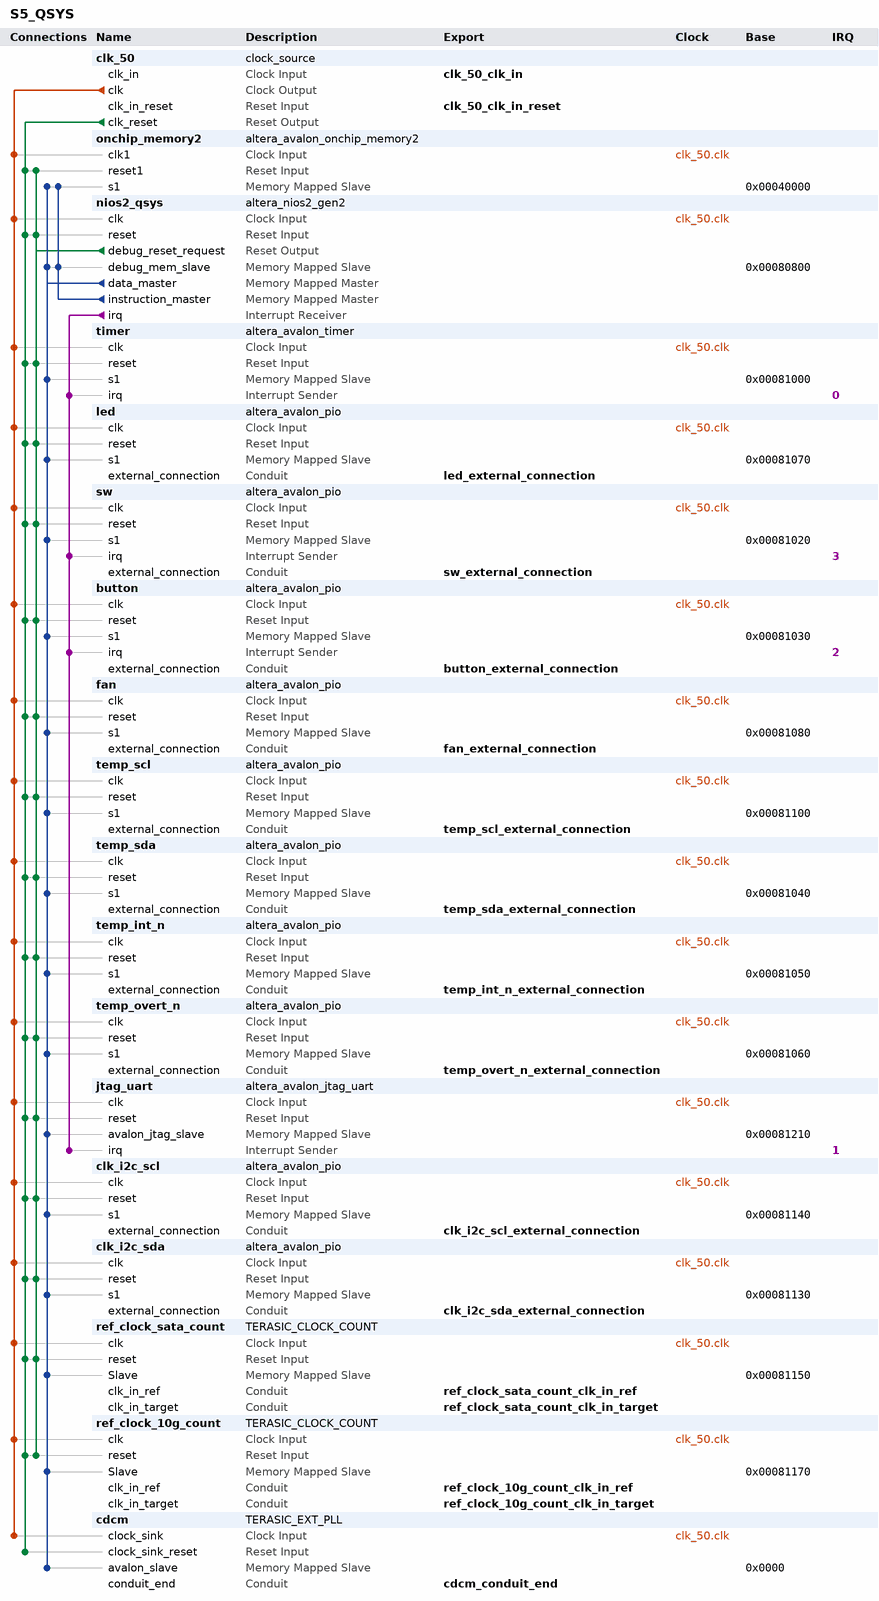
[diagram p0: system contents]
# Platform Designer (Qsys) system S5_QSYS, Stratix V 5SGXEA7N2F45C2
# Parameters at their usual value, and those the tool derives, are not listed.
package require -exact qsys 16.1
create_system S5_QSYS
set_project_property DEVICE_FAMILY {Stratix V}
set_project_property DEVICE 5SGXEA7N2F45C2

add_instance clk_50 clock_source 16.1
set_instance_parameter_value clk_50 clockFrequency 50000000

add_instance onchip_memory2 altera_avalon_onchip_memory2 16.1
set_instance_parameter_value onchip_memory2 dataWidth 32
set_instance_parameter_value onchip_memory2 dualPort false
set_instance_parameter_value onchip_memory2 initMemContent true
set_instance_parameter_value onchip_memory2 initializationFileName onchip_memory2
set_instance_parameter_value onchip_memory2 memorySize 256000

add_instance nios2_qsys altera_nios2_gen2 16.1
set_instance_parameter_value nios2_qsys dcache_size 2048
set_instance_parameter_value nios2_qsys exceptionSlave onchip_memory2.s1
set_instance_parameter_value nios2_qsys icache_size 4096
set_instance_parameter_value nios2_qsys impl Fast
set_instance_parameter_value nios2_qsys resetSlave onchip_memory2.s1
set_instance_parameter_value nios2_qsys setting_activateTrace true

add_instance timer altera_avalon_timer 16.1
set_instance_parameter_value timer period 1
set_instance_parameter_value timer periodUnits MSEC

add_instance led altera_avalon_pio 16.1
set_instance_parameter_value led direction Output
set_instance_parameter_value led width 4

add_instance sw altera_avalon_pio 16.1
set_instance_parameter_value sw captureEdge true
set_instance_parameter_value sw direction Input
set_instance_parameter_value sw edgeType ANY
set_instance_parameter_value sw generateIRQ true
set_instance_parameter_value sw irqType EDGE
set_instance_parameter_value sw width 4

add_instance button altera_avalon_pio 16.1
set_instance_parameter_value button captureEdge true
set_instance_parameter_value button direction Input
set_instance_parameter_value button edgeType FALLING
set_instance_parameter_value button generateIRQ true
set_instance_parameter_value button irqType EDGE
set_instance_parameter_value button width 4

add_instance fan altera_avalon_pio 16.1
set_instance_parameter_value fan direction Output
set_instance_parameter_value fan resetValue 1
set_instance_parameter_value fan width 1

add_instance temp_scl altera_avalon_pio 16.1
set_instance_parameter_value temp_scl direction Output
set_instance_parameter_value temp_scl width 1

add_instance temp_sda altera_avalon_pio 16.1
set_instance_parameter_value temp_sda direction Bidir
set_instance_parameter_value temp_sda width 1

add_instance temp_int_n altera_avalon_pio 16.1
set_instance_parameter_value temp_int_n direction Input
set_instance_parameter_value temp_int_n width 1

add_instance temp_overt_n altera_avalon_pio 16.1
set_instance_parameter_value temp_overt_n direction Input
set_instance_parameter_value temp_overt_n width 1

add_instance jtag_uart altera_avalon_jtag_uart 16.1
set_instance_parameter_value jtag_uart simInteractiveOptions INTERACTIVE_ASCII_OUTPUT

add_instance clk_i2c_scl altera_avalon_pio 16.1
set_instance_parameter_value clk_i2c_scl direction Output
set_instance_parameter_value clk_i2c_scl width 1

add_instance clk_i2c_sda altera_avalon_pio 16.1
set_instance_parameter_value clk_i2c_sda direction Bidir
set_instance_parameter_value clk_i2c_sda width 1

add_instance ref_clock_sata_count TERASIC_CLOCK_COUNT 1.0

add_instance ref_clock_10g_count TERASIC_CLOCK_COUNT 1.0

add_instance cdcm TERASIC_EXT_PLL 1.0

# connections
add_connection clk_50.clk button.clk clock
add_connection clk_50.clk cdcm.clock_sink clock
add_connection clk_50.clk clk_i2c_scl.clk clock
add_connection clk_50.clk clk_i2c_sda.clk clock
add_connection clk_50.clk fan.clk clock
add_connection clk_50.clk jtag_uart.clk clock
add_connection clk_50.clk led.clk clock
add_connection clk_50.clk nios2_qsys.clk clock
add_connection clk_50.clk onchip_memory2.clk1 clock
add_connection clk_50.clk ref_clock_10g_count.clk clock
add_connection clk_50.clk ref_clock_sata_count.clk clock
add_connection clk_50.clk sw.clk clock
add_connection clk_50.clk temp_int_n.clk clock
add_connection clk_50.clk temp_overt_n.clk clock
add_connection clk_50.clk temp_scl.clk clock
add_connection clk_50.clk temp_sda.clk clock
add_connection clk_50.clk timer.clk clock
add_connection clk_50.clk_reset button.reset reset
add_connection clk_50.clk_reset cdcm.clock_sink_reset reset
add_connection clk_50.clk_reset clk_i2c_scl.reset reset
add_connection clk_50.clk_reset clk_i2c_sda.reset reset
add_connection clk_50.clk_reset fan.reset reset
add_connection clk_50.clk_reset jtag_uart.reset reset
add_connection clk_50.clk_reset led.reset reset
add_connection clk_50.clk_reset nios2_qsys.reset reset
add_connection clk_50.clk_reset onchip_memory2.reset1 reset
add_connection clk_50.clk_reset ref_clock_10g_count.reset reset
add_connection clk_50.clk_reset ref_clock_sata_count.reset reset
add_connection clk_50.clk_reset sw.reset reset
add_connection clk_50.clk_reset temp_int_n.reset reset
add_connection clk_50.clk_reset temp_overt_n.reset reset
add_connection clk_50.clk_reset temp_scl.reset reset
add_connection clk_50.clk_reset temp_sda.reset reset
add_connection clk_50.clk_reset timer.reset reset
add_connection nios2_qsys.debug_reset_request button.reset reset
add_connection nios2_qsys.debug_reset_request clk_i2c_scl.reset reset
add_connection nios2_qsys.debug_reset_request clk_i2c_sda.reset reset
add_connection nios2_qsys.debug_reset_request fan.reset reset
add_connection nios2_qsys.debug_reset_request jtag_uart.reset reset
add_connection nios2_qsys.debug_reset_request led.reset reset
add_connection nios2_qsys.debug_reset_request nios2_qsys.reset reset
add_connection nios2_qsys.debug_reset_request onchip_memory2.reset1 reset
add_connection nios2_qsys.debug_reset_request ref_clock_10g_count.reset reset
add_connection nios2_qsys.debug_reset_request ref_clock_sata_count.reset reset
add_connection nios2_qsys.debug_reset_request sw.reset reset
add_connection nios2_qsys.debug_reset_request temp_int_n.reset reset
add_connection nios2_qsys.debug_reset_request temp_overt_n.reset reset
add_connection nios2_qsys.debug_reset_request temp_scl.reset reset
add_connection nios2_qsys.debug_reset_request temp_sda.reset reset
add_connection nios2_qsys.debug_reset_request timer.reset reset
add_connection nios2_qsys.data_master button.s1 avalon
set_connection_parameter_value nios2_qsys.data_master/button.s1 baseAddress 0x00081030
add_connection nios2_qsys.data_master cdcm.avalon_slave avalon
set_connection_parameter_value nios2_qsys.data_master/cdcm.avalon_slave baseAddress 0x0000
add_connection nios2_qsys.data_master clk_i2c_scl.s1 avalon
set_connection_parameter_value nios2_qsys.data_master/clk_i2c_scl.s1 baseAddress 0x00081140
add_connection nios2_qsys.data_master clk_i2c_sda.s1 avalon
set_connection_parameter_value nios2_qsys.data_master/clk_i2c_sda.s1 baseAddress 0x00081130
add_connection nios2_qsys.data_master fan.s1 avalon
set_connection_parameter_value nios2_qsys.data_master/fan.s1 baseAddress 0x00081080
add_connection nios2_qsys.data_master jtag_uart.avalon_jtag_slave avalon
set_connection_parameter_value nios2_qsys.data_master/jtag_uart.avalon_jtag_slave baseAddress 0x00081210
add_connection nios2_qsys.data_master led.s1 avalon
set_connection_parameter_value nios2_qsys.data_master/led.s1 baseAddress 0x00081070
add_connection nios2_qsys.data_master nios2_qsys.debug_mem_slave avalon
set_connection_parameter_value nios2_qsys.data_master/nios2_qsys.debug_mem_slave baseAddress 0x00080800
add_connection nios2_qsys.data_master onchip_memory2.s1 avalon
set_connection_parameter_value nios2_qsys.data_master/onchip_memory2.s1 baseAddress 0x00040000
add_connection nios2_qsys.data_master ref_clock_10g_count.Slave avalon
set_connection_parameter_value nios2_qsys.data_master/ref_clock_10g_count.Slave baseAddress 0x00081170
add_connection nios2_qsys.data_master ref_clock_sata_count.Slave avalon
set_connection_parameter_value nios2_qsys.data_master/ref_clock_sata_count.Slave baseAddress 0x00081150
add_connection nios2_qsys.data_master sw.s1 avalon
set_connection_parameter_value nios2_qsys.data_master/sw.s1 baseAddress 0x00081020
add_connection nios2_qsys.data_master temp_int_n.s1 avalon
set_connection_parameter_value nios2_qsys.data_master/temp_int_n.s1 baseAddress 0x00081050
add_connection nios2_qsys.data_master temp_overt_n.s1 avalon
set_connection_parameter_value nios2_qsys.data_master/temp_overt_n.s1 baseAddress 0x00081060
add_connection nios2_qsys.data_master temp_scl.s1 avalon
set_connection_parameter_value nios2_qsys.data_master/temp_scl.s1 baseAddress 0x00081100
add_connection nios2_qsys.data_master temp_sda.s1 avalon
set_connection_parameter_value nios2_qsys.data_master/temp_sda.s1 baseAddress 0x00081040
add_connection nios2_qsys.data_master timer.s1 avalon
set_connection_parameter_value nios2_qsys.data_master/timer.s1 baseAddress 0x00081000
add_connection nios2_qsys.instruction_master nios2_qsys.debug_mem_slave avalon
set_connection_parameter_value nios2_qsys.instruction_master/nios2_qsys.debug_mem_slave baseAddress 0x00080800
add_connection nios2_qsys.instruction_master onchip_memory2.s1 avalon
set_connection_parameter_value nios2_qsys.instruction_master/onchip_memory2.s1 baseAddress 0x00040000
add_connection nios2_qsys.irq button.irq interrupt
set_connection_parameter_value nios2_qsys.irq/button.irq irqNumber 2
add_connection nios2_qsys.irq jtag_uart.irq interrupt
set_connection_parameter_value nios2_qsys.irq/jtag_uart.irq irqNumber 1
add_connection nios2_qsys.irq sw.irq interrupt
set_connection_parameter_value nios2_qsys.irq/sw.irq irqNumber 3
add_connection nios2_qsys.irq timer.irq interrupt
set_connection_parameter_value nios2_qsys.irq/timer.irq irqNumber 0

# exported interfaces
add_interface button_external_connection conduit end
set_interface_property button_external_connection EXPORT_OF button.external_connection
add_interface cdcm_conduit_end conduit end
set_interface_property cdcm_conduit_end EXPORT_OF cdcm.conduit_end
add_interface clk_50_clk_in clock sink
set_interface_property clk_50_clk_in EXPORT_OF clk_50.clk_in
add_interface clk_50_clk_in_reset reset sink
set_interface_property clk_50_clk_in_reset EXPORT_OF clk_50.clk_in_reset
add_interface clk_i2c_scl_external_connection conduit end
set_interface_property clk_i2c_scl_external_connection EXPORT_OF clk_i2c_scl.external_connection
add_interface clk_i2c_sda_external_connection conduit end
set_interface_property clk_i2c_sda_external_connection EXPORT_OF clk_i2c_sda.external_connection
add_interface fan_external_connection conduit end
set_interface_property fan_external_connection EXPORT_OF fan.external_connection
add_interface led_external_connection conduit end
set_interface_property led_external_connection EXPORT_OF led.external_connection
add_interface ref_clock_10g_count_clk_in_ref conduit end
set_interface_property ref_clock_10g_count_clk_in_ref EXPORT_OF ref_clock_10g_count.clk_in_ref
add_interface ref_clock_10g_count_clk_in_target conduit end
set_interface_property ref_clock_10g_count_clk_in_target EXPORT_OF ref_clock_10g_count.clk_in_target
add_interface ref_clock_sata_count_clk_in_ref conduit end
set_interface_property ref_clock_sata_count_clk_in_ref EXPORT_OF ref_clock_sata_count.clk_in_ref
add_interface ref_clock_sata_count_clk_in_target conduit end
set_interface_property ref_clock_sata_count_clk_in_target EXPORT_OF ref_clock_sata_count.clk_in_target
add_interface sw_external_connection conduit end
set_interface_property sw_external_connection EXPORT_OF sw.external_connection
add_interface temp_int_n_external_connection conduit end
set_interface_property temp_int_n_external_connection EXPORT_OF temp_int_n.external_connection
add_interface temp_overt_n_external_connection conduit end
set_interface_property temp_overt_n_external_connection EXPORT_OF temp_overt_n.external_connection
add_interface temp_scl_external_connection conduit end
set_interface_property temp_scl_external_connection EXPORT_OF temp_scl.external_connection
add_interface temp_sda_external_connection conduit end
set_interface_property temp_sda_external_connection EXPORT_OF temp_sda.external_connection

set_interconnect_requirement {$system} qsys_mm.clockCrossingAdapter HANDSHAKE
set_interconnect_requirement {$system} qsys_mm.maxAdditionalLatency 1

save_system S5_QSYS.qsys
